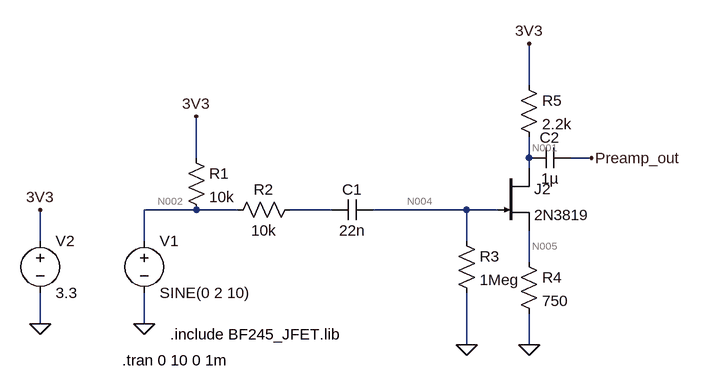
[diagram p0: schematic PreampModel.asc]
PreampModel.asc, the LTspice schematic file:
Version 4
SHEET 1 1112 1312
WIRE 720 144 720 80
WIRE 208 256 208 192
WIRE 720 256 720 224
WIRE 816 256 784 256
WIRE 720 272 720 256
WIRE 208 336 128 336
WIRE 272 336 208 336
WIRE 416 336 352 336
WIRE 624 336 480 336
WIRE 672 336 624 336
WIRE -32 384 -32 336
WIRE 128 384 128 336
WIRE 624 384 624 336
WIRE 720 416 720 368
WIRE -32 512 -32 464
WIRE 128 512 128 464
WIRE 624 544 624 464
WIRE 720 544 720 496
FLAG 208 192 3V3
FLAG 720 80 3V3
FLAG 624 544 0
FLAG 128 512 0
FLAG 720 544 0
FLAG 816 256 Preamp_out
FLAG -32 512 0
FLAG -32 336 3V3
SYMBOL res 192 240 R0
SYMATTR InstName R1
SYMATTR Value 10k
SYMBOL res 368 320 R90
WINDOW 0 0 56 VBottom 2
WINDOW 3 32 56 VTop 2
SYMATTR InstName R2
SYMATTR Value 10k
SYMBOL cap 480 320 R90
WINDOW 0 0 32 VBottom 2
WINDOW 3 32 32 VTop 2
SYMATTR InstName C1
SYMATTR Value 22n
SYMBOL res 608 368 R0
SYMATTR InstName R3
SYMATTR Value 1Meg
SYMBOL res 704 400 R0
SYMATTR InstName R4
SYMATTR Value 750
SYMBOL res 704 128 R0
SYMATTR InstName R5
SYMATTR Value 2.2k
SYMBOL voltage 128 368 R0
WINDOW 123 0 0 Left 0
WINDOW 39 0 0 Left 0
SYMATTR InstName V1
SYMATTR Value SINE(0 2 10)
SYMBOL cap 784 240 R90
WINDOW 0 0 32 VBottom 2
WINDOW 3 32 32 VTop 2
SYMATTR InstName C2
SYMATTR Value 1µ
SYMBOL njf 672 272 R0
SYMATTR InstName J2
SYMATTR Value 2N3819
SYMBOL voltage -32 368 R0
WINDOW 123 0 0 Left 0
WINDOW 39 0 0 Left 0
SYMATTR InstName V2
SYMATTR Value 3.3
TEXT 168 528 Left 2 !.include BF245_JFET.lib
TEXT 94 568 Left 2 !.tran 0 10 0 1m

The netlist it stands for:
* PreampModel.asc
R1 3V3 N002 10k
R2 N003 N002 10k
C1 N004 N003 22n
R3 N004 0 1Meg
R4 N005 0 750
R5 3V3 N001 2.2k
V1 N002 0 SINE(0 2 10)
C2 Preamp_out N001 1µ
J2 N001 N004 N005 2N3819
V2 3V3 0 3.3
.model NJF NJF
.model PJF PJF
.lib standard.jft
.include BF245_JFET.lib
.tran 0 10 0 1m
.backanno
.end

* Results of the author's LTspice run, read from the files saved beside the schematic
* Operating Point, zero values left out:
*   V(3v3) = 3.3 V
*   V(n004) = 2.651 µV
*   V(n005) = 789.9 mV
*   V(n001) = 983 mV
*   V(preamp_out) = 983 nV
*   Id(J2) = 1.053 mA
*   Ig(J2) = -2.651 pA
*   Is(J2) = -1.053 mA
*   I(R5) = 1.053 mA
*   I(R4) = 1.053 mA
*   I(R3) = 2.651 pA
*   I(R1) = 330 µA
*   I(V2) = -1.383 mA
*   I(V1) = 330 µA
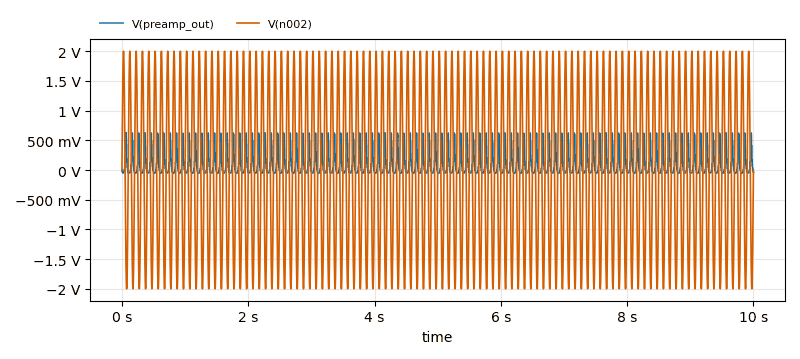
[diagram p1: Transient Analysis of PreampModel.asc, plotted from the saved traces]
* Transient Analysis, 1 run:
*   V(preamp_out): min -50.92 mV, max 632 mV, average 104.9 mV, rms 228.7 mV, last -42.06 mV
*   V(n002): min -2 V, max 2 V, average -63.99 µV, rms 1.414 V, last 0 V